# EAGLE design akabeacon_square_type2_ble121 (EAGLE 7.2.0)
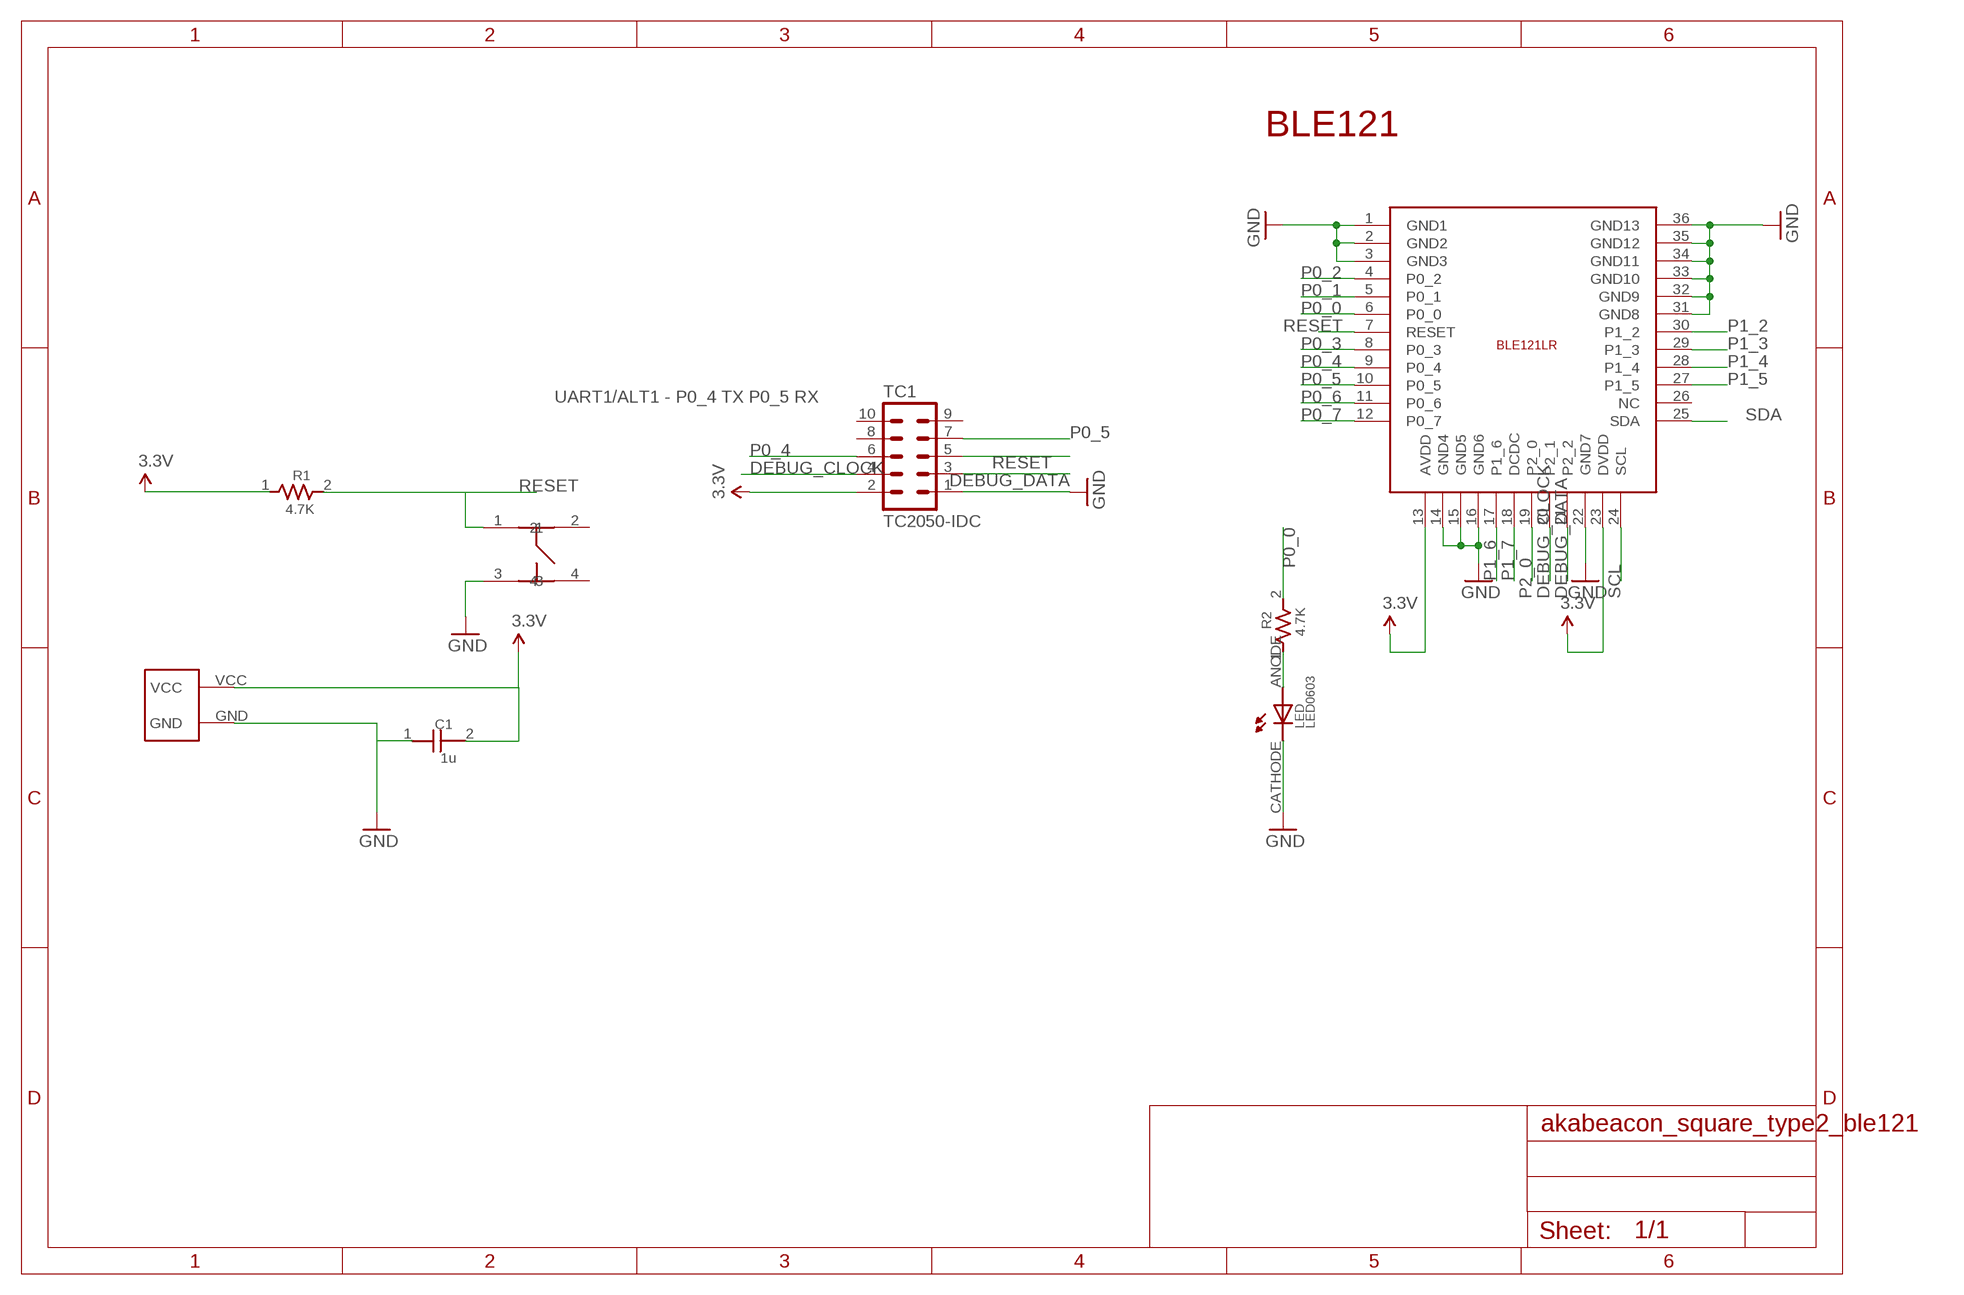
[diagram p0: schematic, sheet 1]

## Parts
BLE1  BLUEGIGA-BLE121LR  [BLUEGIGA-BLE121LR]
C1  1u  CAPACITOR0603  [0603]
LED  LED0603  [0603]
R1  4.7K  RESISTOR0603  [0603]
R2  4.7K  RESISTOR0603  [0603]
TC1  TC2050-IDC  [TC2050-IDC-NL]
U$2  SQUARE-TYPE2-TC2050  [SQUARE-TYPE2-TC2050]
U$6  SWICTH-4P(KMR2)  [SWITCH-4P(KMR2)]

## Nets
3.3V: BLE1.13(AVDD) BLE1.23(DVDD) C1.2 R1.1 TC1.2 U$2.VCC
DEBUG_CLOCK: BLE1.20(P2_1) TC1.4
DEBUG_DATA: BLE1.21(P2_2) TC1.3
GND: BLE1.1(GND1) BLE1.2(GND2) BLE1.3(GND3) BLE1.22(GND7) BLE1.31(GND8) BLE1.32(GND9) BLE1.33(GND10) BLE1.34(GND11) BLE1.35(GND12) BLE1.36(GND13) C1.1 LED.CATHODE TC1.1 U$2.GND U$6.3
N$2: LED.ANODE R2.1
N$8: BLE1.14(GND4) BLE1.15(GND5) BLE1.16(GND6) ; supply symbol labelled GND
P0_0: BLE1.6(P0_0) R2.2
P0_1: BLE1.5(P0_1)
P0_2: BLE1.4(P0_2)
P0_3: BLE1.8(P0_3)
P0_4: BLE1.9(P0_4) TC1.6
P0_5: BLE1.10(P0_5) TC1.7
P0_6: BLE1.11(P0_6)
P0_7: BLE1.12(P0_7)
P1_2: BLE1.30(P1_2)
P1_3: BLE1.29(P1_3)
P1_4: BLE1.28(P1_4)
P1_5: BLE1.27(P1_5)
P1_6: BLE1.17(P1_6)
P1_7: BLE1.18(DCDC)
P2_0: BLE1.19(P2_0)
RESET: BLE1.7(RESET) R1.2 TC1.5 U$6.1
SCL: BLE1.24(SCL)
SDA: BLE1.25(SDA)
Unconnected: BLE1.26(NC) TC1.8 TC1.9 TC1.10 U$6.2 U$6.4

## Notes on the sheet
- BLE121
- UART1/ALT1 - P0_4 TX P0_5 RX

## Library data of the parts
BLE1 = gclueBT:BLUEGIGA-BLE121LR: Bluetooth Bluetooth 4.0 low energy radio Radio Transmit power: +8 dBm Receiver sensitivity: -98 dBm Typical line-of-sight range: up to 450 meters Current Consumption TX peak current: 36 mA, 25 mA (with DC/DC) RX peak current: 33 mA Power mode 1: 2.7 mA Power mode 2: 1.3 uA Power mode 3: 0.5 uA Certifications Japan: MIC Japan certification ( 209-J00111 )
C1 = GClue-Capacitor:CAPACITOR
LED = GClue-LED:LED
R1 R2 = GClue-Resistors:RESISTOR
TC1 = TagConnect:TC2050-IDC: Tag-Connect In Circuit Programming & Debug Cable 10 Pin http://www.tag-connect.com
U$2 = GClue-Beacon:SQUARE-TYPE2-TC2050
U$6 = gclue:SWICTH-4P(KMR2)

## Board
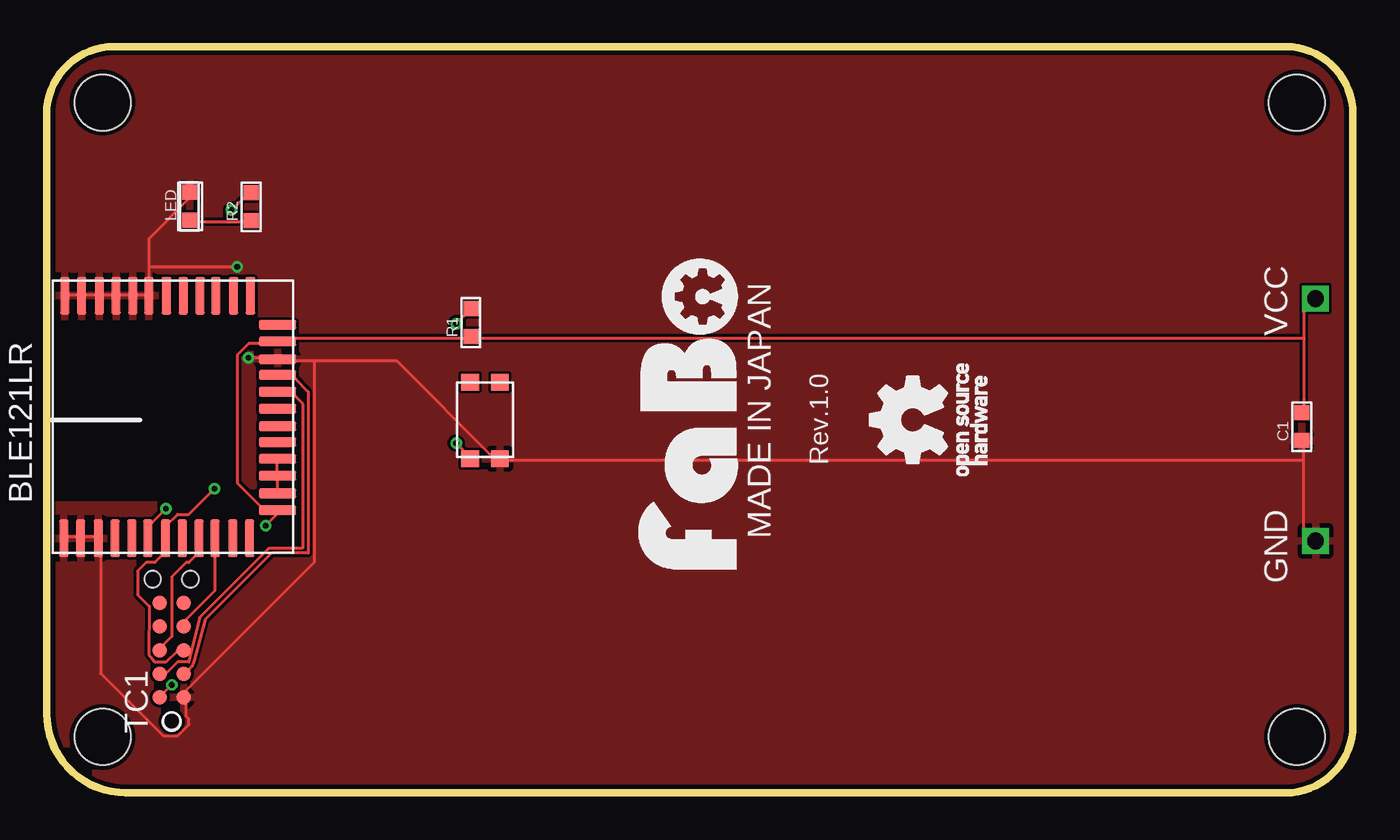
[diagram p1: board, top side]
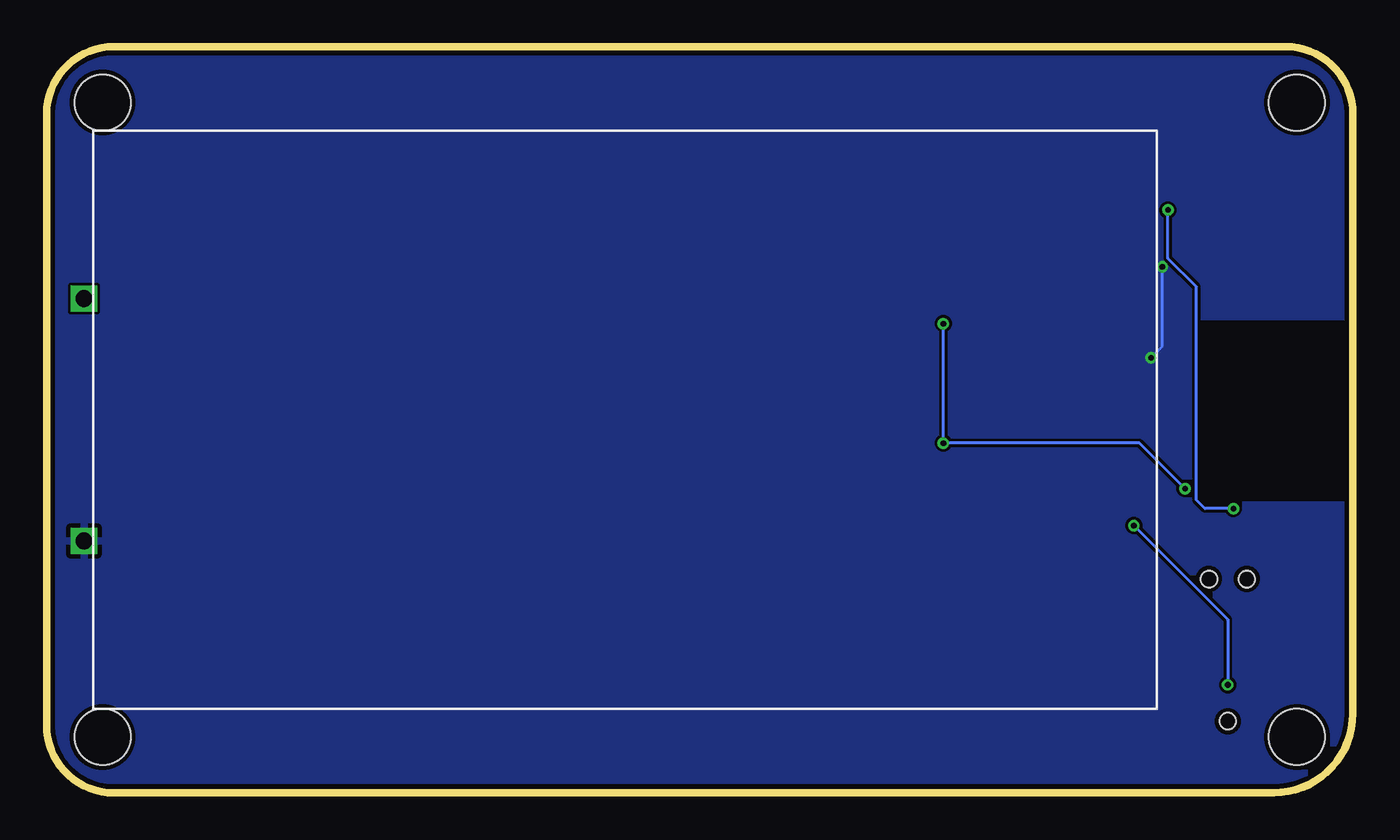
[diagram p2: board, bottom side, seen from below]

Size 70 x 40 mm. Coordinates in mm from the lower left corner, seen from the top.
Copper layers (1*16): Top 0.035mm / dielectric 1.5mm / Bottom 0.035mm
Design rules "SeeedStudio_2layer_DRU_no_angle_20140221": minimum track width 6mil, minimum drill 12mil, track to track 6mil, track to pad 6mil, pad to pad 6mil, via to via 6mil, smd to smd 0mil, copper to edge 10mil, drill to drill 10mil, minimum pad ring 10mil, minimum via ring 6mil, stop-mask expansion 2mil, vias tented up to drill 100mil, thermal gap 10mil
tRestrict: area -1.6,15.6 to 8.1,25.3
bRestrict: area -1.5,15.6 to 8.2,25.3

### Footprints (pad centres in the part's own frame; a part is rotated, then mirrored left to right if it is on the bottom)
BLUEGIGA-BLE121LR = smd 2 x 0.5: 1 -6.4,4.8; 2 -6.4,3.9; 3 -6.4,2.95; 4 -6.4,2.05; 5 -6.4,1.15; 6 -6.4,0.3; 7 -6.4,-0.65; 8 -6.4,-1.55; 9 -6.4,-2.45; 10 -6.4,-3.3; 11 -6.4,-4.25; 12 -6.4,-5.15; 25 6.6,-5.2; 26 6.6,-4.3; 27 6.6,-3.35; 28 6.6,-2.5; 29 6.6,-1.6; 30 6.6,-0.7; 31 6.6,0.25; 32 6.6,1.1; 33 6.6,2; 34 6.6,2.9; 35 6.6,3.85; 36 6.6,4.75 | smd 0.5 x 2: 13 -4.9,-6.65; 14 -4,-6.65; 15 -3.05,-6.65; 16 -2.15,-6.65; 17 -1.25,-6.65; 18 -0.4,-6.65; 19 0.55,-6.65; 20 1.45,-6.65; 21 2.35,-6.65; 22 3.2,-6.65; 23 4.15,-6.65; 24 5.05,-6.65
0603 = smd 0.8 x 0.8: 1 -0.75,0; 2 0.75,0
0603' = smd 0.8 x 0.8: ANODE -0.75,0; CATHODE 0.75,0
TC2050-IDC-NL = smd 0.787 x 0.787: 1 -2.54,-0.635; 2 -2.54,0.635; 3 -1.27,-0.635; 4 -1.27,0.635; 5 0,-0.635; 6 0,0.635; 7 1.27,-0.635; 8 1.27,0.635; 9 2.54,-0.635; 10 2.54,0.635 | hole 0.889: -3.81,0; 3.81,-1.016; 3.81,1.016
SQUARE-TYPE2-TC2050 = drill 0.9 square: GND 33,-6.5; VCC 33,6.5 | hole 3: -32,17; -32,-17; 32,-17; 32,17
SWITCH-4P(KMR2) = smd 0.9 x 0.95: 1 -1,0; 2 3.1,0; 3 -1,-1.6; 4 3.1,-1.6

### Placement (x,y rotation side)
BLE1  5.72,20.05 90 top
C1  67.26,19.63 90 top
LED  LED0603  [0603']  7.66,31.44 90 top
R1  22.74,25.21 90 top
R2  10.96,31.42 90 top
TC1  6.7,7.65 90 top
U$2  35,20 0 top
U$6  22.69,18.91 90 top

### Tracks (layer width: path | path; a pad name or v marks a point on that pad's centre or on a via)
3.3V  (via drill 0.3)
  Top 0.152: v6.71,5.79 6.1,5.18 TC1.2 | v11.73,14.33 12.5,15.09 BLE1.13 12.34,15.24 11.58,15.24 10.21,16.61 10.21,23.47 10.82,24.08 12.34,24.08 BLE1.23 12.5,24.23 12.65,24.38 22.71,24.38 R1.1 22.86,24.38 67.36,24.38 | 67.36,24.38 67.36,25.76 67.97,26.36 U$2.VCC | 67.36,24.38 67.36,20.42 C1.2
  Bottom 0.152: v6.71,5.79 6.71,9.3 v11.73,14.33
DEBUG_CLOCK
  Top 0.152: TC1.4 6.1,6.4 6.4,6.4 7.01,7.01 7.62,7.01 8.2,9.4 11.91,13.11 13.72,13.11 13.72,20.88 13.11,21.49 12.5,21.49 BLE1.20
DEBUG_DATA
  Top 0.152: TC1.3 7.47,6.4 7.8,6.8 7.9,7.1 8.5,9.3 12.05,12.85 14.02,12.85 14.02,21.49 13.26,22.25 12.5,22.25 BLE1.21
GND  (via drill 0.3)
  Top 0.152: BLE1.1 1.07,13.72 1.68,13.72 BLE1.2 1.83,13.72 2.74,13.72 BLE1.3 2.9,13.56 2.9,6.4 6.25,3.05 7.01,3.05 7.62,3.66 7.62,3.96 7.47,4.12 7.47,5.03 TC1.1 7.47,5.18 7.47,5.49 14.33,12.34 14.33,23.16 | BLE1.36 1.07,26.67 1.83,26.67 BLE1.35 1.98,26.67 2.74,26.67 BLE1.34 2.9,26.67 3.66,26.67 BLE1.33 3.81,26.67 4.57,26.67 BLE1.32 4.72,26.67 5.33,26.67 BLE1.31 5.49,26.67 5.49,28.19 | 5.49,28.19 5.49,29.72 7.62,31.85 7.62,32.16 LED.CATHODE | 67.36,17.83 67.36,14.17 67.97,13.56 U$2.GND | 67.36,17.83 67.36,18.75 C1.1 | 14.33,23.16 12.5,23.16 BLE1.22 12.34,23.32 v10.82,23.32 | 14.33,23.16 18.75,23.16 23.93,17.98 24.23,17.98 U$6.3 24.38,17.83 67.36,17.83 | v10.21,28.19 5.49,28.19
  Bottom 0.152: v10.21,28.19 10.21,23.93 v10.82,23.32
  pour Top: 0,0 70,0 70,40 0,40
  pour Bottom: 0,0 70,0 70,40 0,40
N$2
  Top 0.152: R2.1 10.82,30.63 7.77,30.63 LED.ANODE
N$8
  Top 0.152: BLE1.14 12.34,16.15 12.34,16.92 BLE1.15 12.34,17.07 12.34,17.83 BLE1.16
P0_0  (via drill 0.3)
  Top 0.152: v9.91,31.24 10.82,32.16 R2.2 | v6.4,15.24 5.49,14.33 5.49,13.72 BLE1.6
  Bottom 0.152: v9.91,31.24 9.91,28.65 8.38,27.13 8.38,15.7 7.92,15.24 v6.4,15.24
P0_4
  Top 0.152: TC1.6 6.1,7.77 6.71,8.38 6.71,11.58 7.47,12.34 7.62,12.34 8.08,12.8 8.08,13.56 BLE1.9
P0_5
  Top 0.152: TC1.7 7.47,8.99 7.47,9.3 8.99,10.82 8.99,13.56 BLE1.10
RESET  (via drill 0.3)
  Top 0.152: v21.95,25.15 22.71,25.91 R1.2 | v21.95,18.75 22.71,17.98 U$6.1 | TC1.5 7.32,7.62 7.01,7.62 6.4,7.01 5.79,7.01 5.48,7.42 5.5,10 4.88,10.62 4.88,11.89 5.33,12.34 5.79,12.34 6.25,12.8 6.25,13.56 BLE1.7 6.4,13.72 6.4,14.33 7.01,14.94 7.62,14.94 v8.99,16.31
  Bottom 0.152: v21.95,25.15 v21.95,18.75 11.43,18.75 v8.99,16.31

### Text on the board
tPlace: Rev.1.0